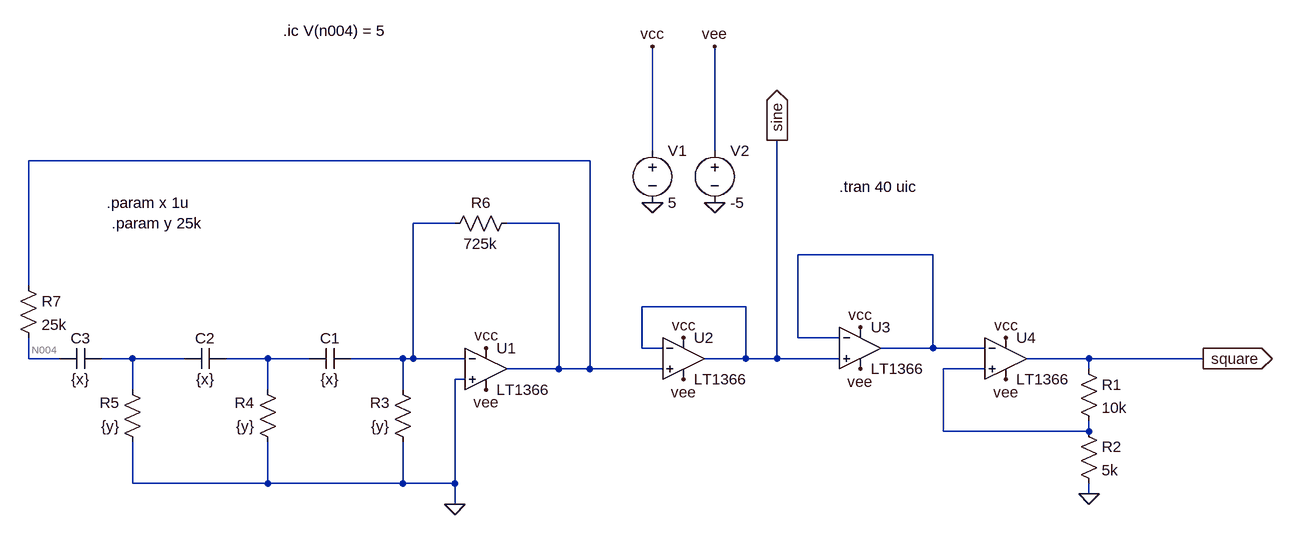
[diagram p0: schematic Draft33.asc]
Draft33.asc, the LTspice schematic file:
Version 4
SHEET 1 1288 680
WIRE 320 48 320 -112
WIRE 416 48 416 -112
WIRE 224 64 -640 64
WIRE 16 160 -48 160
WIRE 176 160 96 160
WIRE 752 208 544 208
WIRE -640 256 -640 64
WIRE 464 288 304 288
WIRE 544 336 544 208
WIRE 608 336 544 336
WIRE 304 352 304 288
WIRE 336 352 304 352
WIRE 752 352 752 208
WIRE 752 352 672 352
WIRE 832 352 752 352
WIRE -640 368 -640 336
WIRE -592 368 -640 368
WIRE -480 368 -528 368
WIRE -400 368 -480 368
WIRE -272 368 -336 368
WIRE -208 368 -272 368
WIRE -64 368 -144 368
WIRE -48 368 -48 160
WIRE -48 368 -64 368
WIRE 32 368 -48 368
WIRE 464 368 464 288
WIRE 464 368 400 368
WIRE 512 368 512 32
WIRE 512 368 464 368
WIRE 608 368 512 368
WIRE 992 368 896 368
WIRE 1168 368 992 368
WIRE 176 384 176 160
WIRE 176 384 96 384
WIRE 224 384 224 64
WIRE 224 384 176 384
WIRE 336 384 224 384
WIRE 832 384 768 384
WIRE 992 384 992 368
WIRE 32 400 16 400
WIRE -480 416 -480 368
WIRE -272 416 -272 368
WIRE -64 416 -64 368
WIRE 768 480 768 384
WIRE 992 480 992 464
WIRE 992 480 768 480
WIRE -480 560 -480 496
WIRE -272 560 -272 496
WIRE -272 560 -480 560
WIRE -64 560 -64 496
WIRE -64 560 -272 560
WIRE 16 560 16 400
WIRE 16 560 -64 560
WIRE 992 576 992 560
WIRE 16 592 16 560
FLAG 992 576 0
FLAG 1168 368 square
IOPIN 1168 368 Out
FLAG 16 592 0
FLAG 416 128 0
FLAG 320 128 0
FLAG 320 -112 vcc
FLAG 416 -112 vee
FLAG 64 352 vcc
FLAG 368 336 vcc
FLAG 64 416 vee
FLAG 368 400 vee
FLAG 512 32 sine
IOPIN 512 32 Out
FLAG 640 320 vcc
FLAG 864 336 vcc
FLAG 640 384 vee
FLAG 864 400 vee
SYMBOL res 976 368 R0
SYMATTR InstName R1
SYMATTR Value 10k
SYMBOL res 976 464 R0
SYMATTR InstName R2
SYMATTR Value 5k
SYMBOL cap -144 352 R90
WINDOW 0 0 32 VBottom 2
WINDOW 3 32 32 VTop 2
SYMATTR InstName C1
SYMATTR Value {x}
SYMBOL cap -336 352 R90
WINDOW 0 0 32 VBottom 2
WINDOW 3 32 32 VTop 2
SYMATTR InstName C2
SYMATTR Value {x}
SYMBOL cap -528 352 R90
WINDOW 0 0 32 VBottom 2
WINDOW 3 32 32 VTop 2
SYMATTR InstName C3
SYMATTR Value {x}
SYMBOL res -48 512 R180
WINDOW 0 36 76 Left 2
WINDOW 3 36 40 Left 2
SYMATTR InstName R3
SYMATTR Value {y}
SYMBOL res -256 512 R180
WINDOW 0 36 76 Left 2
WINDOW 3 36 40 Left 2
SYMATTR InstName R4
SYMATTR Value {y}
SYMBOL res -464 512 R180
WINDOW 0 36 76 Left 2
WINDOW 3 36 40 Left 2
SYMATTR InstName R5
SYMATTR Value {y}
SYMBOL res 0 176 R270
WINDOW 0 32 56 VTop 2
WINDOW 3 0 56 VBottom 2
SYMATTR InstName R6
SYMATTR Value 725k
SYMBOL Opamps/LT1366 64 320 R0
SYMATTR InstName U1
SYMBOL Opamps/LT1366 368 304 R0
SYMATTR InstName U2
SYMBOL voltage 320 32 R0
SYMATTR InstName V1
SYMATTR Value 5
SYMBOL voltage 416 32 R0
SYMATTR InstName V2
SYMATTR Value -5
SYMBOL Opamps/LT1366 640 288 R0
SYMATTR InstName U3
SYMBOL Opamps/LT1366 864 304 R0
SYMATTR InstName U4
SYMBOL res -656 240 R0
SYMATTR InstName R7
SYMATTR Value 25k
TEXT 608 104 Left 2 !.tran 40 uic
TEXT -520 128 Left 2 !.param x 1u
TEXT -512 160 Left 2 !.param y 25k
TEXT -248 -136 Left 2 !.ic V(n004) = 5

The netlist it stands for:
* Draft33.asc
R1 square N007 10k
R2 N007 0 5k
C1 N002 N006 {x}
C2 N006 N005 {x}
C3 N005 N004 {x}
R3 0 N002 {y}
R4 0 N006 {y}
R5 0 N005 {y}
R6 N002 N001 725k
XU1 0 N002 vcc vee N001 LT1366  ; pins In+ In- V+ V- OUT
XU2 N001 sine vcc vee sine LT1366  ; pins In+ In- V+ V- OUT
V1 vcc 0 5
V2 vee 0 -5
XU3 sine N003 vcc vee N003 LT1366  ; pins In+ In- V+ V- OUT
XU4 N007 N003 vcc vee square LT1366  ; pins In+ In- V+ V- OUT
R7 N001 N004 25k
.tran 40 uic
.param x 1u
.param y 25k
.ic V(n004) = 5
.lib LTC.lib
.backanno
.end